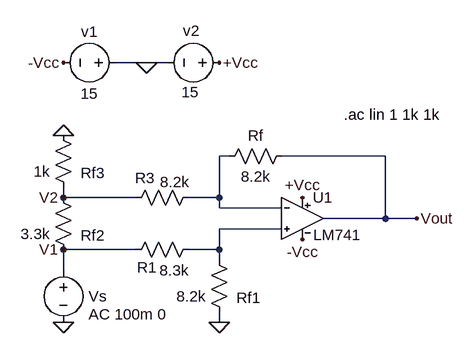
[diagram p0: schematic Subtracter.asc]
Subtracter.asc, the LTspice schematic file:
Version 4
SHEET 1 880 680
WIRE -96 -80 -144 -80
WIRE -64 -80 -96 -80
WIRE 32 64 16 64
WIRE 272 64 112 64
WIRE -224 128 -224 112
WIRE -112 128 -224 128
WIRE 16 128 16 64
WIRE 16 128 -32 128
WIRE 16 144 16 128
WIRE 112 144 16 144
WIRE 272 160 272 64
WIRE 272 160 176 160
WIRE 320 160 272 160
WIRE 112 176 16 176
WIRE -112 208 -224 208
WIRE 16 208 16 176
WIRE 16 208 -32 208
WIRE 16 224 16 208
WIRE -224 240 -224 208
WIRE 16 320 16 304
FLAG -224 320 0
FLAG 16 320 0
FLAG -96 -80 0
FLAG 320 160 Vout
FLAG 144 128 +Vcc
FLAG 144 192 -Vcc
FLAG -224 32 0
FLAG -224 208 V1
FLAG -224 128 V2
FLAG -224 -80 -Vcc
FLAG 16 -80 +Vcc
SYMBOL voltage -128 -80 R90
WINDOW 0 -32 56 VBottom 2
WINDOW 3 32 56 VTop 2
SYMATTR InstName v1
SYMATTR Value 15
SYMBOL voltage 32 -80 R90
WINDOW 0 -49 72 VLeft 2
WINDOW 3 45 47 VRight 2
WINDOW 123 0 0 Left 2
WINDOW 39 0 0 Left 2
SYMATTR InstName v2
SYMATTR Value 15
SYMBOL voltage -224 224 R0
WINDOW 0 39 56 Left 2
WINDOW 3 -250 58 Left 2
WINDOW 123 39 84 Left 2
WINDOW 39 0 0 Left 2
SYMATTR InstName Vs
SYMATTR Value ""
SYMATTR Value2 AC 100m 0
SYMBOL res -16 112 R90
WINDOW 0 1 82 VBottom 2
WINDOW 3 -24 36 VTop 2
SYMATTR InstName R3
SYMATTR Value 8.2k
SYMBOL res 128 48 R90
WINDOW 0 0 56 VBottom 2
WINDOW 3 32 56 VTop 2
SYMATTR InstName Rf
SYMATTR Value 8.2k
SYMBOL res 32 320 R180
WINDOW 0 -48 38 Left 2
WINDOW 3 36 40 Left 2
SYMATTR InstName Rf1
SYMATTR Value 8.2k
SYMBOL res -16 192 R90
WINDOW 0 59 79 VBottom 2
WINDOW 3 32 37 VTop 2
SYMATTR InstName R1
SYMATTR Value 8.3k
SYMBOL res -208 224 R180
WINDOW 0 -48 38 Left 2
WINDOW 3 36 40 Left 2
SYMATTR InstName Rf2
SYMATTR Value 3.3k
SYMBOL res -208 128 R180
WINDOW 0 -48 38 Left 2
WINDOW 3 36 40 Left 2
SYMATTR InstName Rf3
SYMATTR Value 1k
SYMBOL LM741 144 96 R0
SYMATTR InstName U1
TEXT 208 0 Left 2 !.ac lin 1 1k 1k

The netlist it stands for:
* Subtracter.asc
v1 0 -Vcc 15
v2 +Vcc 0 15
Vs V1 0 AC 100m 0
R3 N001 V2 8.2k
Rf Vout N001 8.2k
Rf1 0 N002 8.2k
R1 N002 V1 8.3k
Rf2 V1 V2 3.3k
Rf3 V2 0 1k
XU1 N002 N001 +Vcc -Vcc Vout LM741  ; pins In+ In- V+ V- OUT
.ac lin 1 1k 1k
.lib LM741.lib
.backanno
.end